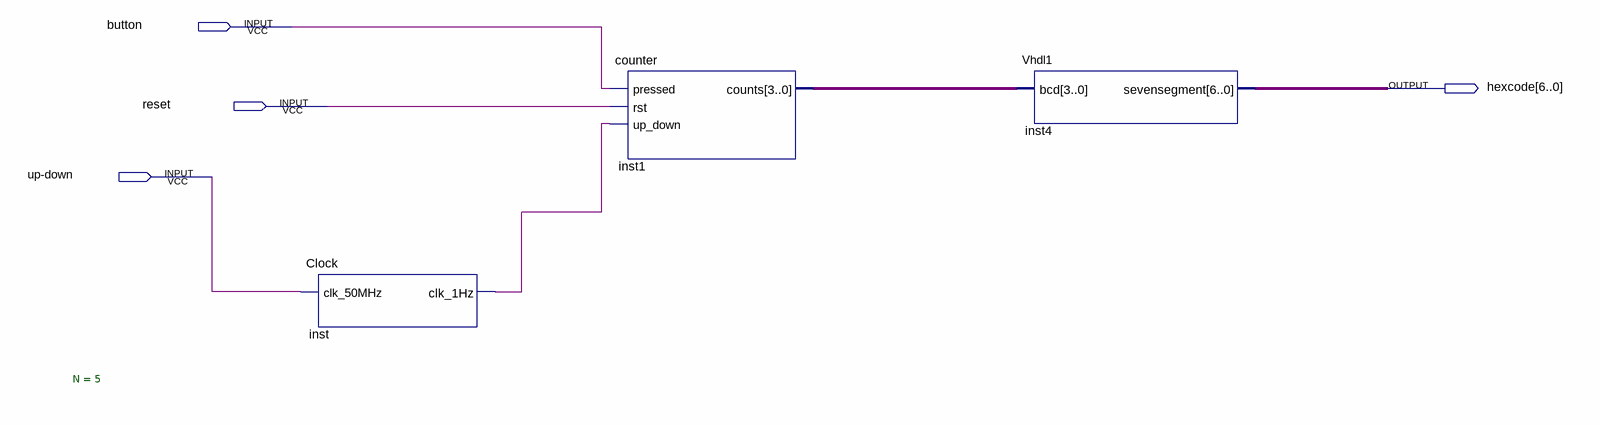
[diagram p0: schematic sheet]
// Quartus schematic Lab10.bdf as structural Verilog: 3 symbols, 4 pins
module Lab10 (
  input  button,
  input  reset,
  input  \up-down ,
  output [6:0] hexcode
);

  wire inst_clk_1hz;
  wire [3:0] inst1_counts;

  Clock #(.N(5)) inst (.clk_50MHz(\up-down ), .clk_1Hz(inst_clk_1hz));
  counter inst1 (.pressed(button), .rst(reset), .up_down(inst_clk_1hz), .counts(inst1_counts));
  Vhdl1 inst4 (.bcd(inst1_counts), .sevensegment(hexcode));
endmodule
